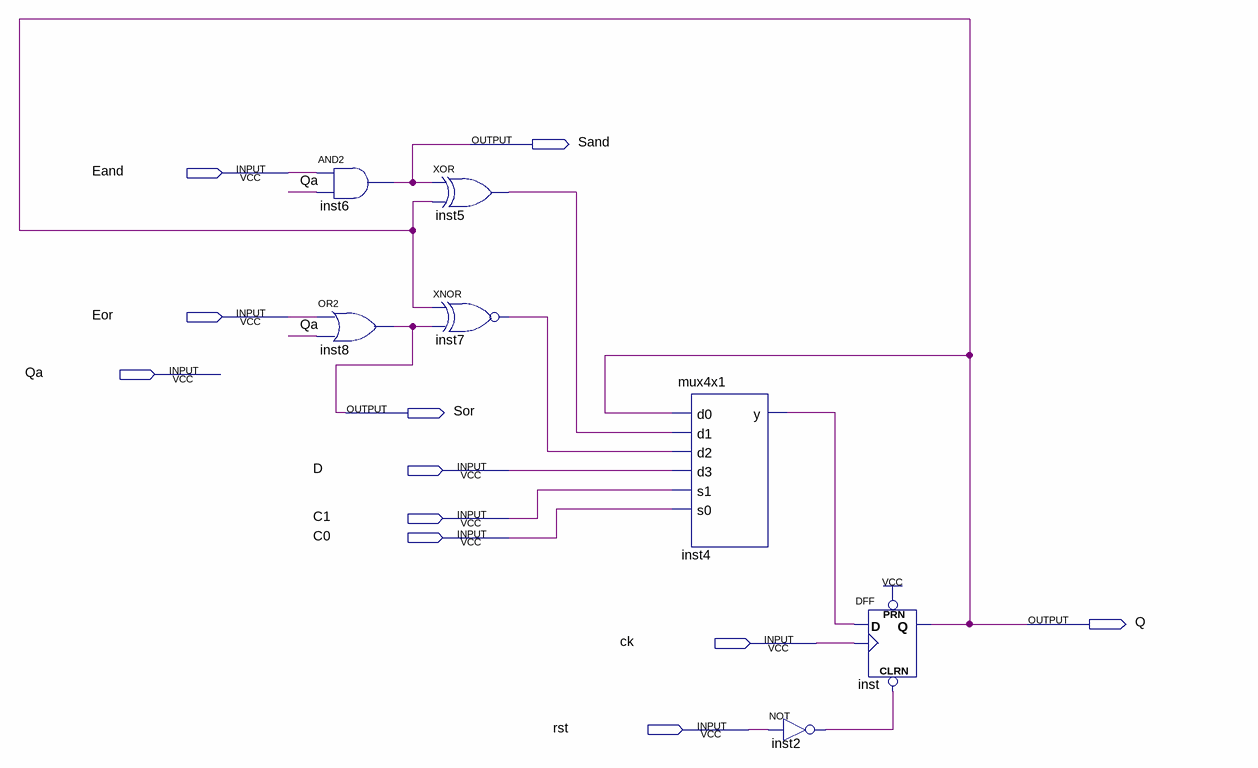
[diagram p0: schematic sheet]
// Quartus schematic unidade_contador.bdf as structural Verilog: 7 symbols, 11 pins
module unidade_contador (
  input  Eand,
  input  Eor,
  input  Qa,
  input  D,
  input  C1,
  input  C0,
  input  ck,
  input  rst,
  output Sand,
  output Sor,
  output Q
);

  wire inst2_out, inst4_y, inst5_out, inst7_out;

  and inst6 (Sand, Eand, Qa);
  or inst8 (Sor, Eor, Qa);
  xor inst5 (inst5_out, Sand, Q);
  xnor inst7 (inst7_out, Q, Sor);
  mux4x1 inst4 (.d0(Q), .d1(inst5_out), .d2(inst7_out), .d3(D), .s1(C1), .s0(C0), .y(inst4_y));
  not inst2 (inst2_out, rst);
  DFF inst (.CLRN(inst2_out), .CLK(ck), .D(inst4_y), .PRN(1'b1), .Q(Q));
endmodule
